# Altium project LXe_digitizer.PrjPcb (part 3 of 3)
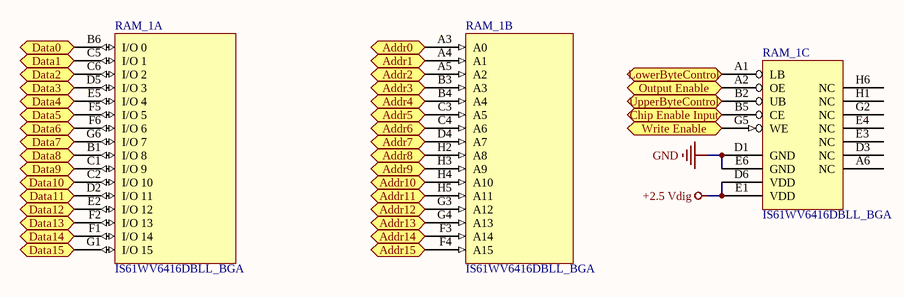
[diagram p12: SRAM.SchDoc]

## Nets that join several sheets
+1.2 Vdig: Ref&Supply Unit (Csup12.+ Csup18.1 Uref6.2 Uref6.4), Processing Unit (52 pins)
+1.8 V: Digit_1 (18 pins), Ref&Supply Unit (Csup20.+ Csup23.1 Uref1.2 Uref1.4), Digit_2 (18 pins), Digit_3 (18 pins)
+1.8 Vdig: Digit_1 (7 pins), Ref&Supply Unit (Csup8.+ Csup14.1 Uref2.2 Uref2.4), Digit_2 (7 pins), Digit_3 (7 pins)
+2.5 Vdig: Ref&Supply Unit (Csup11.+ Csup17.1 Uref5.2 Uref5.4), Processing Unit (65 pins), In-Out (RSL4.2), SRAM (RAM_1.D6 RAM_1.E1)
+3.3 Vclk: Ref&Supply Unit (Csup10.+ Csup16.1 Uref4.2 Uref4.4), Timing Unit (19 pins)
+3.3 Vdig: Main schem (CLED1.1 VDLED1.ANOD VDLED2.ANOD VDLED3.ANOD), Ref&Supply Unit (Csup9.+ Csup15.1 Uref3.2 Uref3.4), Processing Unit (11 pins), In-Out (22 pins), Ethernet (16 pins)
+5 V: Digit_1 (13 pins), Digit_1/Analog_input (Rsh5_Digit_1_Analog_input#1.2 Rsh10_Digit_1_Analog_input#1.2), Digit_1/Analog_input (Rsh5_Digit_1_Analog_input#2.2 Rsh10_Digit_1_Analog_input#2.2), Digit_1/Analog_input (Rsh5_Digit_1_Analog_input#3.2 Rsh10_Digit_1_Analog_input#3.2), Digit_1/Analog_input (Rsh5_Digit_1_Analog_input#4.2 Rsh10_Digit_1_Analog_input#4.2), Ref&Supply Unit (20 pins), Digit_2 (13 pins), Digit_2/Analog_input (Rsh5_Digit_2_Analog_input#1.2 Rsh10_Digit_2_Analog_input#1.2), Digit_2/Analog_input (Rsh5_Digit_2_Analog_input#2.2 Rsh10_Digit_2_Analog_input#2.2), Digit_2/Analog_input (Rsh5_Digit_2_Analog_input#3.2 Rsh10_Digit_2_Analog_input#3.2), Digit_2/Analog_input (Rsh5_Digit_2_Analog_input#4.2 Rsh10_Digit_2_Analog_input#4.2), Digit_3 (13 pins), Digit_3/Analog_input (Rsh5_Digit_3_Analog_input#1.2 Rsh10_Digit_3_Analog_input#1.2), Digit_3/Analog_input (Rsh5_Digit_3_Analog_input#2.2 Rsh10_Digit_3_Analog_input#2.2), Digit_3/Analog_input (Rsh5_Digit_3_Analog_input#3.2 Rsh10_Digit_3_Analog_input#3.2), Digit_3/Analog_input (Rsh5_Digit_3_Analog_input#4.2 Rsh10_Digit_3_Analog_input#4.2)
+12 V: Main schem (LX1.1), Ref&Supply Unit (12 pins), In-Out (CSAin_1.23 CSAin_2.23)
-2 V: Digit_1 (12 pins), Digit_1/Analog_input (Ush1_Digit_1_Analog_input#1.2 Ush2_Digit_1_Analog_input#1.4), Digit_1/Analog_input (Ush1_Digit_1_Analog_input#2.2 Ush2_Digit_1_Analog_input#2.4), Digit_1/Analog_input (Ush1_Digit_1_Analog_input#3.2 Ush2_Digit_1_Analog_input#3.4), Digit_1/Analog_input (Ush1_Digit_1_Analog_input#4.2 Ush2_Digit_1_Analog_input#4.4), Ref&Supply Unit (Csup25.- Csup26.1 Rref10.1 Uref7.3), Digit_2 (12 pins), Digit_2/Analog_input (Ush1_Digit_2_Analog_input#1.2 Ush2_Digit_2_Analog_input#1.4), Digit_2/Analog_input (Ush1_Digit_2_Analog_input#2.2 Ush2_Digit_2_Analog_input#2.4), Digit_2/Analog_input (Ush1_Digit_2_Analog_input#3.2 Ush2_Digit_2_Analog_input#3.4), Digit_2/Analog_input (Ush1_Digit_2_Analog_input#4.2 Ush2_Digit_2_Analog_input#4.4), Digit_3 (12 pins), Digit_3/Analog_input (Ush1_Digit_3_Analog_input#1.2 Ush2_Digit_3_Analog_input#1.4), Digit_3/Analog_input (Ush1_Digit_3_Analog_input#2.2 Ush2_Digit_3_Analog_input#2.4), Digit_3/Analog_input (Ush1_Digit_3_Analog_input#3.2 Ush2_Digit_3_Analog_input#3.4), Digit_3/Analog_input (Ush1_Digit_3_Analog_input#4.2 Ush2_Digit_3_Analog_input#4.4)
-4 V: Ref&Supply Unit (25 pins), In-Out (CSAin_1.22 CSAin_2.22)
GND: Main schem (11 pins), Digit_1 (41 pins), Digit_1/Analog_input (9 pins), Digit_1/Analog_input (9 pins), Digit_1/Analog_input (9 pins), Digit_1/Analog_input (9 pins), Ref&Supply Unit (54 pins), Processing Unit (140 pins), Timing Unit (13 pins), In-Out (58 pins), Ethernet (32 pins), Digit_2 (41 pins), Digit_2/Analog_input (9 pins), Digit_2/Analog_input (9 pins), Digit_2/Analog_input (9 pins), Digit_2/Analog_input (9 pins), Digit_3 (41 pins), Digit_3/Analog_input (9 pins), Digit_3/Analog_input (9 pins), Digit_3/Analog_input (9 pins), Digit_3/Analog_input (9 pins), SRAM (RAM_1.D1 RAM_1.E6)
LinkClk_N: Processing Unit (U4.Y1), In-Out (RSL3.1 XSL1.4)
LinkClk_P: Processing Unit (U4.Y2), In-Out (RSL3.2 XSL1.3)
Vcm: Digit_1 (6 pins), Digit_2 (6 pins), Digit_3 (6 pins)
VOffset+: Digit_1 (9 pins), Digit_2 (9 pins), Digit_3 (9 pins)
ADC_1_CLK_N: Digit_1 (U3_Digit_1.21), Timing Unit (Uclk1.15)
ADC_1_CLK_P: Digit_1 (U3_Digit_1.22), Timing Unit (Uclk1.16)
ADC_2_CLK_N: Timing Unit (Uclk1.13), Digit_2 (U3_Digit_2.21)
ADC_2_CLK_P: Timing Unit (Uclk1.14), Digit_2 (U3_Digit_2.22)
ADC_3_CLK_N: Timing Unit (Uclk1.11), Digit_3 (U3_Digit_3.21)
ADC_3_CLK_P: Timing Unit (Uclk1.12), Digit_3 (U3_Digit_3.22)
ADC_Clock: Processing Unit (U4.F17), Timing Unit (UG2.2)
ADC_Dch1_0_N: Digit_1 (R34_Digit_1.2 U3_Digit_1.4), Processing Unit (U4.AB13)
ADC_Dch1_0_P: Digit_1 (R34_Digit_1.1 U3_Digit_1.3), Processing Unit (U4.AA13)
ADC_Dch1_1_N: Digit_1 (R33_Digit_1.2 U3_Digit_1.2), Processing Unit (U4.AB14)
ADC_Dch1_1_P: Digit_1 (R33_Digit_1.1 U3_Digit_1.1), Processing Unit (U4.AA14)
ADC_Dch2_0_N: Digit_1 (R35_Digit_1.1 U3_Digit_1.56), Processing Unit (U4.AB15)
ADC_Dch2_0_P: Digit_1 (R35_Digit_1.2 U3_Digit_1.55), Processing Unit (U4.AA15)
ADC_Dch2_1_N: Digit_1 (R36_Digit_1.1 U3_Digit_1.54), Processing Unit (U4.AB16)
ADC_Dch2_1_P: Digit_1 (R36_Digit_1.2 U3_Digit_1.53), Processing Unit (U4.AA16)
ADC_Dch3_0_N: Digit_1 (R37_Digit_1.1 U3_Digit_1.46), Processing Unit (U4.AB20)
ADC_Dch3_0_P: Digit_1 (R37_Digit_1.2 U3_Digit_1.45), Processing Unit (U4.AA20)
ADC_Dch3_1_N: Digit_1 (R38_Digit_1.1 U3_Digit_1.44), Processing Unit (U4.Y22)
ADC_Dch3_1_P: Digit_1 (R38_Digit_1.2 U3_Digit_1.43), Processing Unit (U4.Y21)
ADC_Dch4_0_N: Digit_1 (R44_Digit_1.1 U3_Digit_1.42), Processing Unit (U4.W22)
ADC_Dch4_0_P: Digit_1 (R44_Digit_1.2 U3_Digit_1.41), Processing Unit (U4.W21)
ADC_Dch4_1_N: Digit_1 (R45_Digit_1.1 U3_Digit_1.40), Processing Unit (U4.V22)
ADC_Dch4_1_P: Digit_1 (R45_Digit_1.2 U3_Digit_1.39), Processing Unit (U4.V21)
ADC_Dch5_0_N: Processing Unit (U4.U22), Digit_2 (R34_Digit_2.2 U3_Digit_2.4)
ADC_Dch5_0_P: Processing Unit (U4.U21), Digit_2 (R34_Digit_2.1 U3_Digit_2.3)
ADC_Dch5_1_N: Processing Unit (U4.R22), Digit_2 (R33_Digit_2.2 U3_Digit_2.2)
ADC_Dch5_1_P: Processing Unit (U4.R21), Digit_2 (R33_Digit_2.1 U3_Digit_2.1)
ADC_Dch6_0_N: Processing Unit (U4.P22), Digit_2 (R35_Digit_2.1 U3_Digit_2.56)
ADC_Dch6_0_P: Processing Unit (U4.P21), Digit_2 (R35_Digit_2.2 U3_Digit_2.55)
ADC_Dch6_1_N: Processing Unit (U4.N22), Digit_2 (R36_Digit_2.1 U3_Digit_2.54)
ADC_Dch6_1_P: Processing Unit (U4.N21), Digit_2 (R36_Digit_2.2 U3_Digit_2.53)
ADC_Dch7_0_N: Processing Unit (U4.J22), Digit_2 (R37_Digit_2.1 U3_Digit_2.46)
ADC_Dch7_0_P: Processing Unit (U4.J21), Digit_2 (R37_Digit_2.2 U3_Digit_2.45)
ADC_Dch7_1_N: Processing Unit (U4.H22), Digit_2 (R38_Digit_2.1 U3_Digit_2.44)
ADC_Dch7_1_P: Processing Unit (U4.H21), Digit_2 (R38_Digit_2.2 U3_Digit_2.43)
ADC_Dch8_0_N: Processing Unit (U4.F22), Digit_2 (R44_Digit_2.1 U3_Digit_2.42)
ADC_Dch8_0_P: Processing Unit (U4.F21), Digit_2 (R44_Digit_2.2 U3_Digit_2.41)
ADC_Dch8_1_N: Processing Unit (U4.E22), Digit_2 (R45_Digit_2.1 U3_Digit_2.40)
ADC_Dch8_1_P: Processing Unit (U4.E21), Digit_2 (R45_Digit_2.2 U3_Digit_2.39)
ADC_Dch9_0_N: Processing Unit (U4.D22), Digit_3 (R34_Digit_3.2 U3_Digit_3.4)
ADC_Dch9_0_P: Processing Unit (U4.D21), Digit_3 (R34_Digit_3.1 U3_Digit_3.3)
ADC_Dch9_1_N: Processing Unit (U4.C22), Digit_3 (R33_Digit_3.2 U3_Digit_3.2)
ADC_Dch9_1_P: Processing Unit (U4.C21), Digit_3 (R33_Digit_3.1 U3_Digit_3.1)
ADC_Dch10_0_N: Processing Unit (U4.B22), Digit_3 (R35_Digit_3.1 U3_Digit_3.56)
ADC_Dch10_0_P: Processing Unit (U4.B21), Digit_3 (R35_Digit_3.2 U3_Digit_3.55)
ADC_Dch10_1_N: Processing Unit (U4.A18), Digit_3 (R36_Digit_3.1 U3_Digit_3.54)
ADC_Dch10_1_P: Processing Unit (U4.B18), Digit_3 (R36_Digit_3.2 U3_Digit_3.53)
ADC_Dch11_0_N: Processing Unit (U4.A16), Digit_3 (R37_Digit_3.1 U3_Digit_3.46)
ADC_Dch11_0_P: Processing Unit (U4.B16), Digit_3 (R37_Digit_3.2 U3_Digit_3.45)
ADC_Dch11_1_N: Processing Unit (U4.A15), Digit_3 (R38_Digit_3.1 U3_Digit_3.44)
ADC_Dch11_1_P: Processing Unit (U4.B15), Digit_3 (R38_Digit_3.2 U3_Digit_3.43)
ADC_Dch12_0_N: Processing Unit (U4.A14), Digit_3 (R44_Digit_3.1 U3_Digit_3.42)
ADC_Dch12_0_P: Processing Unit (U4.B14), Digit_3 (R44_Digit_3.2 U3_Digit_3.41)
ADC_Dch12_1_N: Processing Unit (U4.A13), Digit_3 (R45_Digit_3.1 U3_Digit_3.40)
ADC_Dch12_1_P: Processing Unit (U4.B13), Digit_3 (R45_Digit_3.2 U3_Digit_3.39)
ADC_DCLK_1_N: Digit_1 (R39_Digit_1.2 U3_Digit_1.51), Processing Unit (U4.Y17)
ADC_DCLK_1_P: Digit_1 (R39_Digit_1.1 U3_Digit_1.50), Processing Unit (U4.W17)
ADC_DCLK_2_N: Processing Unit (U4.M20), Digit_2 (R39_Digit_2.2 U3_Digit_2.51)
ADC_DCLK_2_P: Processing Unit (U4.M19), Digit_2 (R39_Digit_2.1 U3_Digit_2.50)
ADC_DCLK_3_N: Processing Unit (U4.C13), Digit_3 (R39_Digit_3.2 U3_Digit_3.51)
ADC_DCLK_3_P: Processing Unit (U4.D13), Digit_3 (R39_Digit_3.1 U3_Digit_3.50)
ADC_FCLK_1_N: Digit_1 (R40_Digit_1.2 U3_Digit_1.49), Processing Unit (U4.AB17)
ADC_FCLK_1_P: Digit_1 (R40_Digit_1.1 U3_Digit_1.48), Processing Unit (U4.AA17)
ADC_FCLK_2_N: Processing Unit (U4.M22), Digit_2 (R40_Digit_2.2 U3_Digit_2.49)
ADC_FCLK_2_P: Processing Unit (U4.M21), Digit_2 (R40_Digit_2.1 U3_Digit_2.48)
ADC_FCLK_3_N: Processing Unit (U4.A17), Digit_3 (R40_Digit_3.2 U3_Digit_3.49)
ADC_FCLK_3_P: Processing Unit (U4.B17), Digit_3 (R40_Digit_3.1 U3_Digit_3.48)
AddrRAM0: Processing Unit (U4.V9), SRAM (RAM_1.A3)
AddrRAM1: Processing Unit (U4.U9), SRAM (RAM_1.A4)
AddrRAM2: Processing Unit (U4.V8), SRAM (RAM_1.A5)
AddrRAM3: Processing Unit (U4.T8), SRAM (RAM_1.B3)
AddrRAM4: Processing Unit (U4.U8), SRAM (RAM_1.B4)
AddrRAM5: Processing Unit (U4.R7), SRAM (RAM_1.C3)
AddrRAM6: Processing Unit (U4.T7), SRAM (RAM_1.C4)
AddrRAM7: Processing Unit (U4.P7), SRAM (RAM_1.D4)
AddrRAM8: Processing Unit (U4.P2), SRAM (RAM_1.H2)
AddrRAM9: Processing Unit (U4.R1), SRAM (RAM_1.H3)
AddrRAM10: Processing Unit (U4.R2), SRAM (RAM_1.H4)
AddrRAM11: Processing Unit (U4.V1), SRAM (RAM_1.H5)
AddrRAM12: Processing Unit (U4.U2), SRAM (RAM_1.G3)
AddrRAM13: Processing Unit (U4.V3), SRAM (RAM_1.G4)
AddrRAM14: Processing Unit (U4.T4), SRAM (RAM_1.F3)
AddrRAM15: Processing Unit (U4.R5), SRAM (RAM_1.F4)
C_C_LED: Main schem (RLED1.2), Processing Unit (U4.N1)
CE_RAM: Processing Unit (U4.Y3), SRAM (RAM_1.B5)
COL: Processing Unit (U4.AA7), Ethernet (U7.62)
CRS: Processing Unit (U4.AB7), Ethernet (U7.63)
CSA_IN+_1: Digit_1/Analog_input (Csh1_Digit_1_Analog_input#4.1), In-Out (CSAin_1.18)
CSA_IN+_2: Digit_1/Analog_input (Csh1_Digit_1_Analog_input#3.1), In-Out (CSAin_1.17)
CSA_IN+_3: Digit_1/Analog_input (Csh1_Digit_1_Analog_input#2.1), In-Out (CSAin_1.16)
CSA_IN+_4: Digit_1/Analog_input (Csh1_Digit_1_Analog_input#1.1), In-Out (CSAin_1.12)
CSA_IN+_5: In-Out (CSAin_1.11), Digit_2/Analog_input (Csh1_Digit_2_Analog_input#4.1)
CSA_IN+_6: In-Out (CSAin_1.10), Digit_2/Analog_input (Csh1_Digit_2_Analog_input#3.1)
CSA_IN+_7: In-Out (CSAin_2.18), Digit_2/Analog_input (Csh1_Digit_2_Analog_input#2.1)
CSA_IN+_8: In-Out (CSAin_2.17), Digit_2/Analog_input (Csh1_Digit_2_Analog_input#1.1)
CSA_IN+_9: In-Out (CSAin_2.16), Digit_3/Analog_input (Csh1_Digit_3_Analog_input#4.1)
CSA_IN+_10: In-Out (CSAin_2.12), Digit_3/Analog_input (Csh1_Digit_3_Analog_input#3.1)
CSA_IN+_11: In-Out (CSAin_2.11), Digit_3/Analog_input (Csh1_Digit_3_Analog_input#2.1)
CSA_IN+_12: In-Out (CSAin_2.10), Digit_3/Analog_input (Csh1_Digit_3_Analog_input#1.1)
CSA_IN-_1: Digit_1/Analog_input (Csh2_Digit_1_Analog_input#4.1), In-Out (CSAin_1.9)
CSA_IN-_2: Digit_1/Analog_input (Csh2_Digit_1_Analog_input#3.1), In-Out (CSAin_1.8)
CSA_IN-_3: Digit_1/Analog_input (Csh2_Digit_1_Analog_input#2.1), In-Out (CSAin_1.7)
CSA_IN-_4: Digit_1/Analog_input (Csh2_Digit_1_Analog_input#1.1), In-Out (CSAin_1.3)
CSA_IN-_5: In-Out (CSAin_1.2), Digit_2/Analog_input (Csh2_Digit_2_Analog_input#4.1)
CSA_IN-_6: In-Out (CSAin_1.1), Digit_2/Analog_input (Csh2_Digit_2_Analog_input#3.1)
CSA_IN-_7: In-Out (CSAin_2.9), Digit_2/Analog_input (Csh2_Digit_2_Analog_input#2.1)
CSA_IN-_8: In-Out (CSAin_2.8), Digit_2/Analog_input (Csh2_Digit_2_Analog_input#1.1)
CSA_IN-_9: In-Out (CSAin_2.7), Digit_3/Analog_input (Csh2_Digit_3_Analog_input#4.1)
CSA_IN-_10: In-Out (CSAin_2.3), Digit_3/Analog_input (Csh2_Digit_3_Analog_input#3.1)
CSA_IN-_11: In-Out (CSAin_2.2), Digit_3/Analog_input (Csh2_Digit_3_Analog_input#2.1)
CSA_IN-_12: In-Out (CSAin_2.1), Digit_3/Analog_input (Csh2_Digit_3_Analog_input#1.1)
DataRAM0: Processing Unit (U4.W6), SRAM (RAM_1.B6)
DataRAM1: Processing Unit (U4.U7), SRAM (RAM_1.C5)
DataRAM2: Processing Unit (U4.V5), SRAM (RAM_1.C6)
DataRAM3: Processing Unit (U4.R6), SRAM (RAM_1.D5)
DataRAM4: Processing Unit (U4.T5), SRAM (RAM_1.E5)
DataRAM5: Processing Unit (U4.Y4), SRAM (RAM_1.F5)
DataRAM6: Processing Unit (U4.V4), SRAM (RAM_1.F6)
DataRAM7: Processing Unit (U4.V2), SRAM (RAM_1.G6)
DataRAM8: Processing Unit (U4.T10), SRAM (RAM_1.B1)
DataRAM9: Processing Unit (U4.P6), SRAM (RAM_1.C1)
DataRAM10: Processing Unit (U4.P5), SRAM (RAM_1.C2)
DataRAM11: Processing Unit (U4.P4), SRAM (RAM_1.D2)
DataRAM12: Processing Unit (U4.P3), SRAM (RAM_1.E2)
DataRAM13: Processing Unit (U4.P1), SRAM (RAM_1.F2)
DataRAM14: Processing Unit (U4.T3), SRAM (RAM_1.F1)
DataRAM15: Processing Unit (U4.U1), SRAM (RAM_1.G1)
DEN: Processing Unit (U4.B2), In-Out (UFL1.19)
ERR_LED: Main schem (RLED3.2), Processing Unit (U4.M1)
EthRX_CLK: Processing Unit (U4.W10), Ethernet (U7.52)
EthRX_D V: Processing Unit (U4.Y10), Ethernet (U7.49)
EthRXD0: Processing Unit (U4.Y8), Ethernet (U7.48)
EthRXD1: Processing Unit (U4.W8), Ethernet (U7.47)
EthRXD2: Processing Unit (U4.Y7), Ethernet (U7.46)
EthRXD3: Processing Unit (U4.W7), Ethernet (U7.45)
EthTX_CLK: Processing Unit (U4.AA10), Ethernet (U7.55)
EthTX_EN: Processing Unit (U4.AB10), Ethernet (U7.56)
EthTXD0: Processing Unit (U4.AA9), Ethernet (U7.57)
EthTXD1: Processing Unit (U4.AB9), Ethernet (U7.58)
EthTXD2: Processing Unit (U4.AA8), Ethernet (U7.59)
EthTXD3: Processing Unit (U4.AB8), Ethernet (U7.60)
FLData1: Processing Unit (U4.A3), In-Out (UFL1.21)
FLData2: Processing Unit (U4.B3), In-Out (UFL1.22)
FLData3: Processing Unit (U4.A4), In-Out (UFL1.23)
FLData4: Processing Unit (U4.B4), In-Out (UFL1.24)
FLData5: Processing Unit (U4.A5), In-Out (UFL1.25)
FLData6: Processing Unit (U4.B5), In-Out (UFL1.26)
FLData7: Processing Unit (U4.A6), In-Out (UFL1.27)
FLData8: Processing Unit (U4.B6), In-Out (UFL1.28)
FLData9: Processing Unit (U4.A7), In-Out (UFL1.33)
FLData10: Processing Unit (U4.B7), In-Out (UFL1.34)
FLData11: Processing Unit (U4.A8), In-Out (UFL1.35)
FLData12: Processing Unit (U4.B8), In-Out (UFL1.36)
FLData13: Processing Unit (U4.A9), In-Out (UFL1.37)
FLData14: Processing Unit (U4.B9), In-Out (UFL1.38)
FQuartz: Processing Unit (U4.G17), Timing Unit (UG1.3), Ethernet (R54.1 U7.1)
LB_RAM: Processing Unit (U4.V10), SRAM (RAM_1.A1)
NBit0: Processing Unit (U4.A10), In-Out (UFL1.39)
NBit1: Processing Unit (U4.B10), In-Out (UFL1.40)
NetCsh11_Digit_1_Analog_input#1_2: Digit_1 (R8_Digit_1.1 R15_Digit_1.2), Digit_1/Analog_input (Csh11_Digit_1_Analog_input#1.2)
NetCsh11_Digit_1_Analog_input#2_2: Digit_1 (R7_Digit_1.1 R13_Digit_1.2), Digit_1/Analog_input (Csh11_Digit_1_Analog_input#2.2)
NetCsh11_Digit_1_Analog_input#3_2: Digit_1 (R6_Digit_1.1 R11_Digit_1.2), Digit_1/Analog_input (Csh11_Digit_1_Analog_input#3.2)
NetCsh11_Digit_1_Analog_input#4_2: Digit_1 (R5_Digit_1.1 R9_Digit_1.2), Digit_1/Analog_input (Csh11_Digit_1_Analog_input#4.2)
NetCsh11_Digit_2_Analog_input#1_2: Digit_2 (R8_Digit_2.1 R15_Digit_2.2), Digit_2/Analog_input (Csh11_Digit_2_Analog_input#1.2)
NetCsh11_Digit_2_Analog_input#2_2: Digit_2 (R7_Digit_2.1 R13_Digit_2.2), Digit_2/Analog_input (Csh11_Digit_2_Analog_input#2.2)
NetCsh11_Digit_2_Analog_input#3_2: Digit_2 (R6_Digit_2.1 R11_Digit_2.2), Digit_2/Analog_input (Csh11_Digit_2_Analog_input#3.2)
NetCsh11_Digit_2_Analog_input#4_2: Digit_2 (R5_Digit_2.1 R9_Digit_2.2), Digit_2/Analog_input (Csh11_Digit_2_Analog_input#4.2)
NetCsh11_Digit_3_Analog_input#1_2: Digit_3 (R8_Digit_3.1 R15_Digit_3.2), Digit_3/Analog_input (Csh11_Digit_3_Analog_input#1.2)
NetCsh11_Digit_3_Analog_input#2_2: Digit_3 (R7_Digit_3.1 R13_Digit_3.2), Digit_3/Analog_input (Csh11_Digit_3_Analog_input#2.2)
NetCsh11_Digit_3_Analog_input#3_2: Digit_3 (R6_Digit_3.1 R11_Digit_3.2), Digit_3/Analog_input (Csh11_Digit_3_Analog_input#3.2)
NetCsh11_Digit_3_Analog_input#4_2: Digit_3 (R5_Digit_3.1 R9_Digit_3.2), Digit_3/Analog_input (Csh11_Digit_3_Analog_input#4.2)
OE_RAM: Processing Unit (U4.U10), SRAM (RAM_1.A2)
Ok_LED: Main schem (RLED2.2), Processing Unit (U4.N2)
R_Sync: Processing Unit (U4.C7), In-Out (UFL1.20 XFL1.3)
REN: Processing Unit (U4.C2), In-Out (UFL1.2)
Reset_ADC: Digit_1 (U3_Digit_1.24), Processing Unit (U4.H17)
Reset_ADC: Processing Unit (U4.H18), Digit_2 (U3_Digit_2.24)
Reset_ADC: Processing Unit (U4.G18), Digit_3 (U3_Digit_3.24)
RPWDN: Processing Unit (U4.C1), In-Out (UFL1.1)
SCLK: Digit_1 (U3_Digit_1.16), Processing Unit (U4.W20), Digit_2 (U3_Digit_2.16), Digit_3 (U3_Digit_3.16)
SDATA: Digit_1 (U3_Digit_1.17), Processing Unit (U4.U11)
SDATA: Processing Unit (U4.T17), Digit_2 (U3_Digit_2.17)
SDATA: Processing Unit (U4.C19), Digit_3 (U3_Digit_3.17)
SDOUT: Digit_1 (U3_Digit_1.19), Processing Unit (U4.W15)
SDOUT: Processing Unit (U4.K18), Digit_2 (U3_Digit_2.19)
SDOUT: Processing Unit (U4.D15), Digit_3 (U3_Digit_3.19)
SEN: Digit_1 (U3_Digit_1.18), Processing Unit (U4.W14)
SEN: Processing Unit (U4.T18), Digit_2 (U3_Digit_2.18)
SEN: Processing Unit (U4.D19), Digit_3 (U3_Digit_3.18)
SerClk: Processing Unit (U4.B1), In-Out (UFL1.17)
SLink_Data_N: Processing Unit (U4.AB5), In-Out (RSL2.2 XSL1.2)
SLink_Data_P: Processing Unit (U4.AA5), In-Out (RSL1.2 XSL1.1)
TPWDN: Processing Unit (U4.C8), In-Out (UFL1.42)
UB_RAM: Processing Unit (U4.T9), SRAM (RAM_1.B2)
WE_RAM: Processing Unit (U4.AB3), SRAM (RAM_1.G5)